# EAGLE design DAQ13 (EAGLE 6.0)
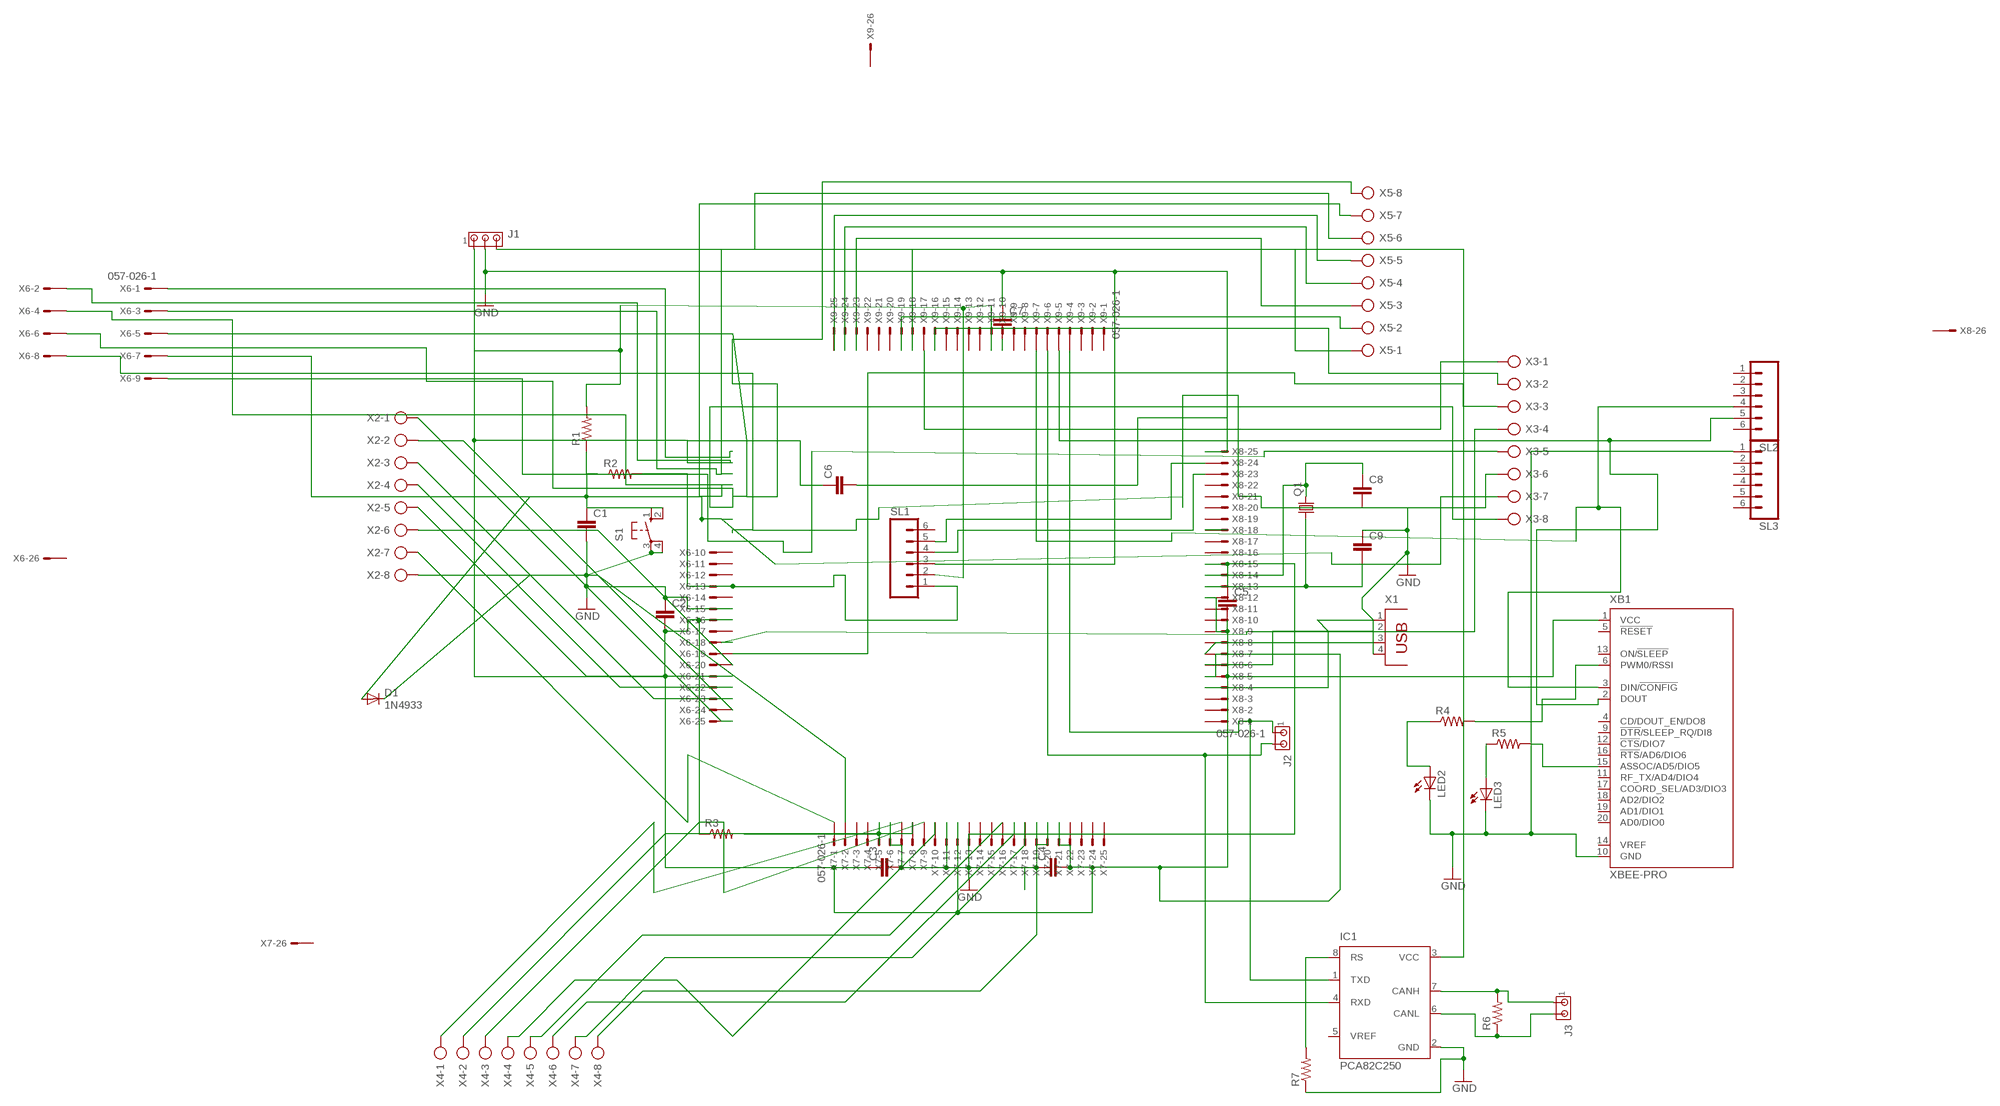
[diagram p0: schematic, sheet 1]

## Parts
C1  C2,5-3  [C2.5-3]
C2  C2.5/2  [C2.5-2]
C3  C2.5/2  [C2.5-2]
C4  C2.5/2  [C2.5-2]
C5  C2.5/2  [C2.5-2]
C6  C2.5/2  [C2.5-2]
C7  C2.5/2  [C2.5-2]
C8  C2,5-3  [C2.5-3]
C9  C2,5-3  [C2.5-3]
D1  1N4933  [DO41-10]
IC1  PCA82C250  [DIL08]
J1  MTA03-156  [1X3MTA]
J2  MTA02-156  [1X2MTA]
J3  MTA02-156  [1X2MTA]
LED2  LED3MM  [LED3MM]
LED3  LED3MM  [LED3MM]
Q1  CRYSTALHC18U-V  [HC18U-V]
R1  R-US_0204/7  [0204/7]
R2  R-US_0204/7  [0204/7]
R3  R-US_0204/7  [0204/7]
R4  R-US_0204/7  [0204/7]
R5  R-US_0204/7  [0204/7]
R6  R-US_0204/7  [0204/7]
R7  R-US_0204/7  [0204/7]
S1  10-XX  [B3F-10XX]
SL1  MA06  [06PA]
SL2  MA06  [06PA]
SL3  MA06  [06PA]
X1  PN87520  [PN87520]
X2  AK300/8  [AK300/8]
X3  AK300/8  [AK300/8]
X4  AK300/8  [AK300/8]
X5  AK300/8  [AK300/8]
X6  057-026-1  [057-026-1]
X7  057-026-1  [057-026-1]
X8  057-026-1  [057-026-1]
X9  057-026-1  [057-026-1]
XB1  XBEE-PRO  [XBEE-PRO]

## Nets
GND: C1.2 C2.1 C3.2 C4.1 C5.1 C6.2 C7.1 C8.2 C9.1 D1.C IC1.2(GND) J1.2 LED2.K(C) LED3.K(C) R7.1 S1.3(P) S1.4(P1) SL1.3 SL3.1 X1.4 X6.15 X7.6 X7.11 X7.20 X8.15 X8.25 XB1.10(GND)
N$1: R2.2 SL1.1 X6.13
N$2: C1.1 D1.A R1.1 R2.1 S1.1(S) S1.2(S1)
N$3: C2.2 C3.1 C4.2 C5.2 C6.1 J1.1 R1.2 R3.1 SL1.2 X6.2 X6.16 X7.12 X7.21 X8.5 X8.12 X9.11 XB1.1(VCC)
N$4: C7.2 X9.10
N$5: R4.2 XB1.6(PWM0/RSSI)
N$6: SL1.4 X8.23
N$7: SL1.5 X8.24
N$8: C8.1 Q1.2 X8.14
N$9: C9.2 Q1.1 X8.13
N$10: R5.2 XB1.15(ASSOC/AD5/DIO5)
N$11: LED3.A R5.1
N$12: LED2.A R4.1
N$13: X4.7 X7.18
N$14: X4.5 X7.16
N$15: X1.1 X8.4
N$16: X1.2 X8.6
N$17: X1.3 X8.7
N$18: X4.6 X7.17
N$19: X2.1 X6.25
N$20: X2.2 X6.24
N$21: X2.3 X6.23
N$22: X2.4 X6.22
N$23: X2.5 X6.21
N$24: X2.6 X6.20
N$25: X2.7 X7.1
N$26: X2.8 X7.2
N$27: X4.1 X7.7
N$28: X4.2 X7.8
N$29: X4.3 X7.9
N$30: X4.4 X7.10
N$31: X4.8 X7.19
N$32: X3.8 X6.6
N$33: X3.7 X6.7
N$34: X5.7 X6.4
N$35: X3.5 X6.9
N$36: X3.4 X6.18
N$37: X3.3 X6.19
N$38: X3.2 X9.16
N$39: X3.1 X9.17
N$40: X5.1 X9.18
N$41: X5.2 X9.19
N$42: X5.3 X9.23
N$43: X5.4 X9.24
N$44: X5.5 X9.25
N$45: X3.6 X6.8
N$46: X5.8 X6.5
N$47: IC1.7(CANH) J3.1 R6.2
N$48: IC1.8(RS) R7.2
N$49: X8.18
N$50: IC1.1(TXD) J2.1 X9.4
N$51: IC1.6(CANL) J3.2 R6.1
N$53: IC1.4(RXD) J2.2 X9.6
N$54: IC1.3(VCC) J1.3
N$56: SL2.5 X9.5 XB1.2(DOUT)
N$57: SL2.4 X9.7 XB1.3(DIN/!CONFIG)
N$58: X6.1
N$59: X5.6 X6.3
N$92: R3.2 X7.5
Unconnected: IC1.5(VREF) SL1.6 SL2.1 SL2.2 SL2.3 SL2.6 SL3.2 SL3.3 SL3.4 SL3.5 SL3.6 X6.10 X6.11 X6.12 X6.14 X6.17 X6.26 X7.3 X7.4 X7.13 X7.14 X7.15 X7.22 X7.23 X7.24 X7.25 X7.26 X8.1 X8.2 X8.3 X8.8 X8.9 X8.10 X8.11 X8.16 X8.17 X8.19 X8.20 X8.21 X8.22 X8.26 X9.1 X9.2 X9.3 X9.8 X9.9 X9.12 X9.13 X9.14 X9.15 X9.20 X9.21 X9.22 X9.26 XB1.4(CD/DOUT_EN/DO8) XB1.5(!RESET) XB1.9(!DTR!/SLEEP_RQ/DI8) XB1.11(RF_TX/AD4/DIO4) XB1.12(!CTS!/DIO7) XB1.13(ON/!SLEEP) XB1.14(VREF) XB1.16(!RTS!/AD6/DIO6) XB1.17(COORD_SEL/AD3/DIO3) XB1.18(AD2/DIO2) XB1.19(AD1/DIO1) XB1.20(AD0/DIO0)

## Library data of the parts
C1-C9 = capacitor-wima:C: CAPACITOR naming: grid - package width
D1 = diode:1N4933: DIODE fast recovery rectifier, 1A
IC1 = micro-philips:PCA82C250: CAN CONTROLLER INTERFACE; OC_FARNELL: 3692358; OC_NEWARK: unknown
J1 = con-amp:MTA03-156: AMP connector
J2 J3 = con-amp:MTA02-156: AMP connector
LED2 LED3 = led:LED: LED OSRAM: - CHIPLED LG R971, LG N971, LY N971, LG Q971, LY Q971, LO R971, LY R971 LH N974, LH R974 LS Q976, LO Q976, LY Q976 LO Q996 - Hyper CHIPLED LW Q18S LB Q993, LB Q99A, LB R99A - SideLED LS A670, LO A670, LY A670, LG A670, LP A670 LB A673, LV A673, LT A673, LW A673 LH A674 LY A675 LS A676, LA A676, LO A676, LY A676, LW A676 LS A679, LY A679, LG A679 - Hyper Micro SIDELED® LS Y876, LA Y876, LO Y876, LY Y876 LT Y87S - SmartLED LW L88C, LW L88S LB L89C, LB L89S, LG L890 LS L89K, LO L89K, LY L89K LS L896, LA L896, LO L896, LY L896 - TOPLED LS T670, LO T670, LY T670, LG T670, LP T670 LSG T670, LSP T670, LSY T670, LOP T670, LYG T670 LG T671, LOG T671, LSG T671 LB T673, LV T673, LT T673, LW T673 LH T674 LS T676, LA T676, LO T676, LY T676, LB T676, LH T676, LSB T676, LW T676 LB T67C, LV T67C, LT T67C, LS T67K, LO T67K, LY T67K, LW E67C LS E67B, LA E67B, LO E67B, LY E67B, LB E67C, LV E67C, LT E67C LW T67C LS T679, LY T679, LG T679 LS T770, LO T770, LY T770, LG T770, LP T770 LB T773, LV T773, LT T773, LW T773 LH T774 LS E675, LA E675, LY E675, LS T675 LS T776, LA T776, LO T776, LY T776, LB T776 LHGB T686 LT T68C, LB T68C - Hyper Mini TOPLED® LB M676 - Mini TOPLED Santana® LG M470 LS M47K, LO M47K, LY M47K Source: http://www.osram.convergy.de LUXEON: - LUMILED® LXK2-PW12-R00, LXK2-PW12-S00, LXK2-PW14-U00, LXK2-PW14-V00 LXK2-PM12-R00, LXK2-PM12-S00, LXK2-PM14-U00 LXK2-PE12-Q00, LXK2-PE12-R00, LXK2-PE12-S00, LXK2-PE14-T00, LXK2-PE14-U00 LXK2-PB12-K00, LXK2-PB12-L00, LXK2-PB12-M00, LXK2-PB14-N00, LXK2-PB14-P00, LXK2-PB14-Q00 LXK2-PR12-L00, LXK2-PR12-M00, LXK2-PR14-Q00, LXK2-PR14-R00 LXK2-PD12-Q00, LXK2-PD12-R00, LXK2-PD12-S00 LXK2-PH12-R00, LXK2-PH12-S00 LXK2-PL12-P00, LXK2-PL12-Q00, LXK2-PL12-R00 Source: www.luxeon.com KINGBRIGHT: KA-3528ASYC Source: www.kingbright.com
Q1 = crystal:CRYSTAL: CRYSTAL; OC_FARNELL: unknown; OC_NEWARK: unknown
R1-R7 = rcl:R-US_: RESISTOR, American symbol
S1 = switch-omron:10-XX: OMRON SWITCH; MPN: B3F-1000; OC_FARNELL: 176432; OC_NEWARK: 36M3542
SL1-SL3 = con-amp-quick:MA06: AMP QUICK CONNECTOR; OC_FARNELL: unknown; OC_NEWARK: unknown
X1 = con-berg:PN87520: BERG USB connector; OC_FARNELL: unknown; OC_NEWARK: unknown
X2-X5 = con-ptr500:AK300/8: CONNECTOR; OC_FARNELL: unknown; OC_NEWARK: unknown
X6-X9 = con-panduit:057-026-: CONNECTOR 20-pin series 057 contact pc board low profile headers; OC_FARNELL: unknown; OC_NEWARK: unknown
XB1 = maxstream:XBEE: XBee (TM) /XBee-PRO(TM) OEM RF Modules Source: MaxStream, Inc. xbee_productmanual.pdf; MPN: XBP24-AWI-001; OC_FARNELL: 1337916; OC_NEWARK: 42M2667

## Board
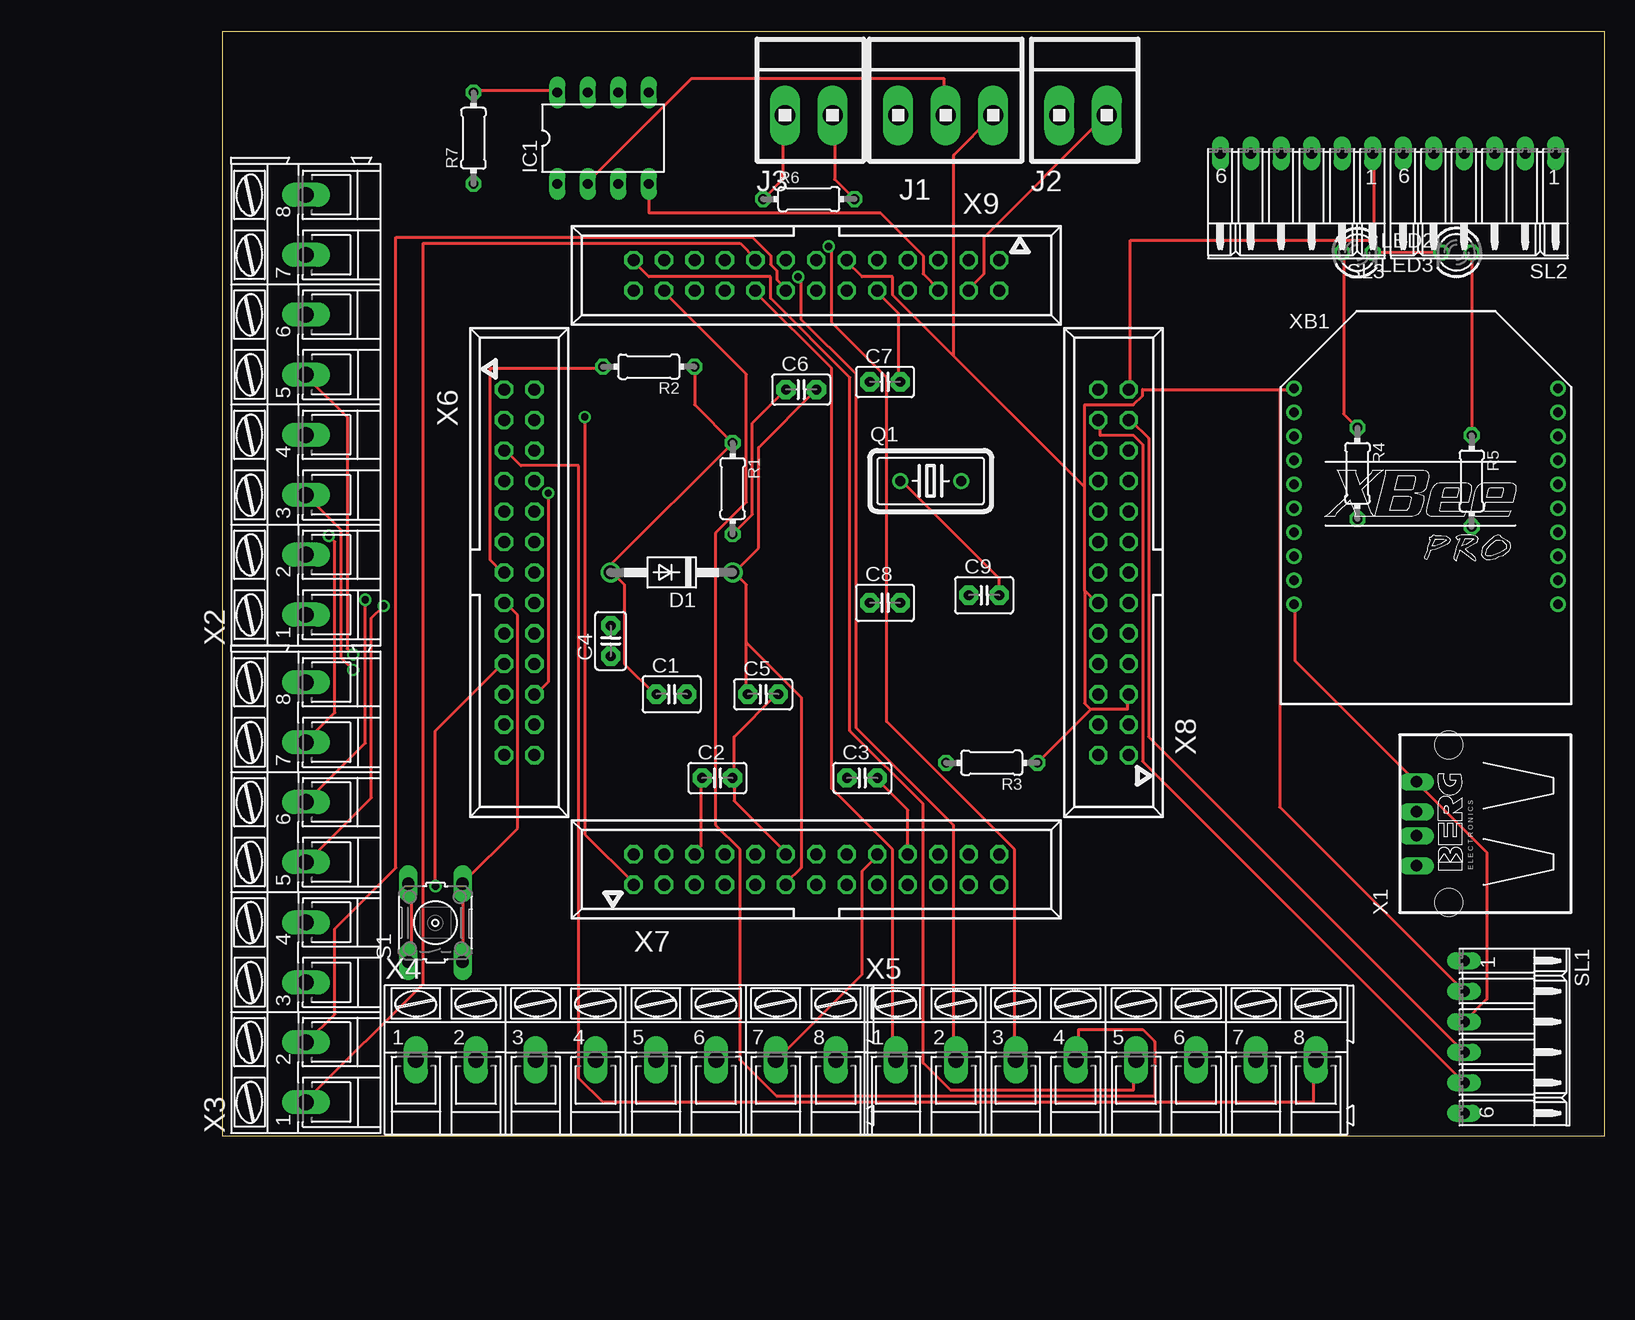
[diagram p1: board, top side]
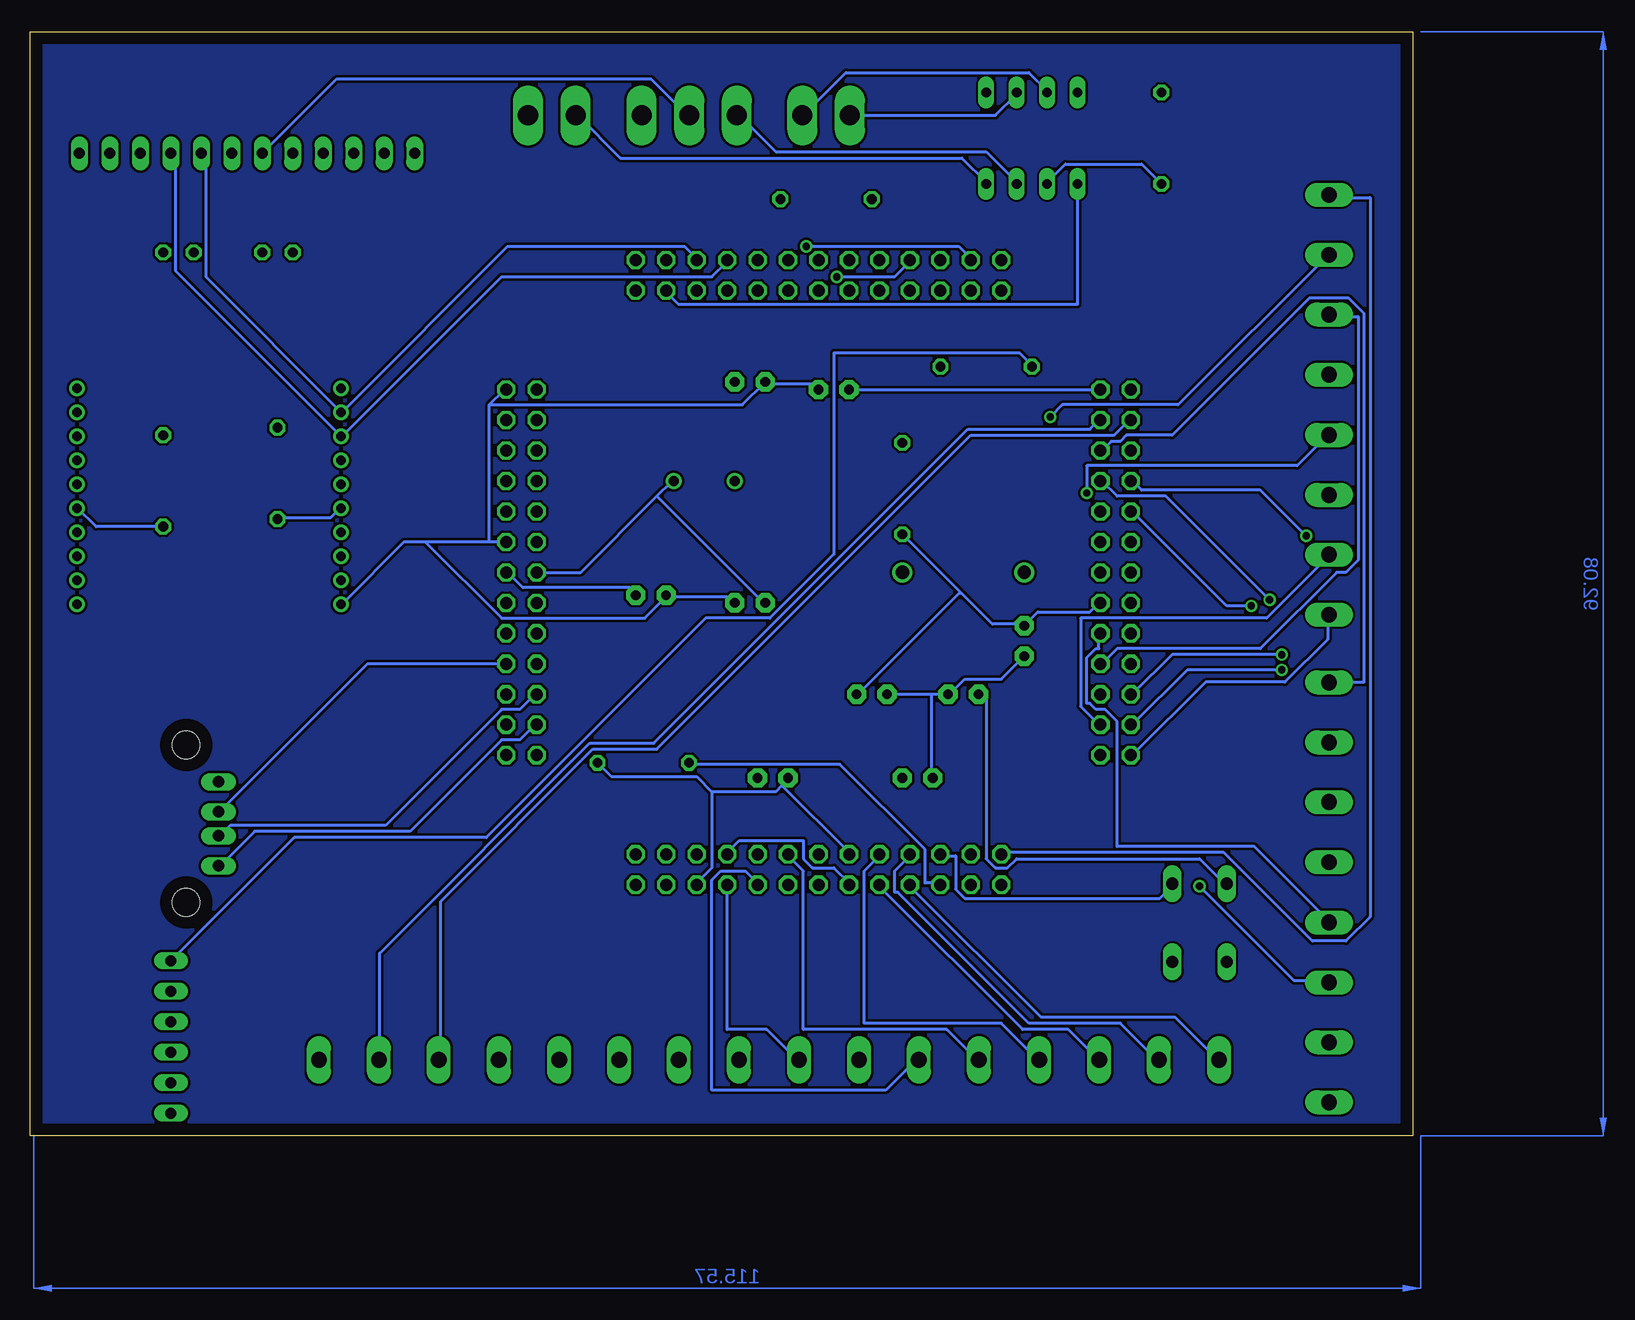
[diagram p2: board, bottom side, seen from below]

Size 115.24 x 92.06 mm. Coordinates in mm from the lower left corner, seen from the top.
Outline: 0,0 115.24,0 115.24,92.06 0,92.06 0,0
Copper layers (1*16): Top 0.035mm / dielectric 1.5mm / Bottom 0.035mm
Design rules: minimum track width 10mil, minimum drill 24mil, track to track 8mil, track to pad 8mil, pad to pad 8mil, via to via 8mil, smd to smd 8mil, copper to edge 40mil, drill to drill 8mil, minimum pad ring 10mil, minimum via ring 8mil, stop-mask expansion 4mil, vias tented up to drill 0mil, thermal gap 10mil

### Footprints (pad centres in the part's own frame; a part is rotated, then mirrored left to right if it is on the bottom)
C2.5-3 = drill 0.813 pad 1.6 octagon: 1 -1.27,0; 2 1.27,0
C2.5-2 = drill 0.813 pad 1.6 octagon: 1 -1.27,0; 2 1.27,0
DO41-10 = drill 1.118: A 5.08,0; C -5.08,0
DIL08 = drill 0.813 long: 1 -3.81,-3.81; 2 -1.27,-3.81; 3 1.27,-3.81; 4 3.81,-3.81; 5 3.81,3.81; 6 1.27,3.81; 7 -1.27,3.81; 8 -3.81,3.81
1X3MTA = drill 1.676 long: 1 3.937,0; 2 -0.025,0; 3 -3.988,0
1X2MTA = drill 1.676 long: 1 1.981,0; 2 -1.981,0
LED3MM = drill 0.813 octagon: A -1.27,0; K 1.27,0
HC18U-V = drill 0.813: 1 -2.54,0; 2 2.54,0
0204/7 = drill 0.813 octagon: 1 -3.81,0; 2 3.81,0
B3F-10XX = drill 1.016 long: 1 -3.251,2.261; 2 3.251,2.261; 3 -3.251,-2.261; 4 3.251,-2.261
06PA = drill 0.914 long: 1 -6.35,0; 2 -3.81,0; 3 -1.27,0; 4 1.27,0; 5 3.81,0; 6 6.35,0
PN87520 = drill 0.95 long: 1 -3.5,2.71; 2 -1,2.71; 3 1,2.71; 4 3.5,2.71 | hole 2.3: -6.57,0; 6.57,0
AK300/8 = drill 1.321 long: 1 -17.501,0; 2 -12.497,0; 3 -7.518,0; 4 -2.515,0; 5 2.515,0; 6 7.518,0; 7 12.497,0; 8 17.501,0
057-026-1 = drill 1 octagon: 1 -15.24,-1.27; 2 -15.24,1.27; 3 -12.7,-1.27; 4 -12.7,1.27; 5 -10.16,-1.27; 6 -10.16,1.27; 7 -7.62,-1.27; 8 -7.62,1.27; 9 -5.08,-1.27; 10 -5.08,1.27; 11 -2.54,-1.27; 12 -2.54,1.27; 13 0,-1.27; 14 0,1.27; 15 2.54,-1.27; 16 2.54,1.27; 17 5.08,-1.27; 18 5.08,1.27; 19 7.62,-1.27; 20 7.62,1.27; 21 10.16,-1.27; 22 10.16,1.27; 23 12.7,-1.27; 24 12.7,1.27; 25 15.24,-1.27; 26 15.24,1.27
XBEE-PRO = drill 0.8 pad 1.27: 1 -11,9; 2 -11,7; 3 -11,5; 4 -11,3; 5 -11,1; 6 -11,-1; 7 -11,-3; 8 -11,-5; 9 -11,-7; 10 -11,-9; 11 11,-9; 12 11,-7; 13 11,-5; 14 11,-3; 15 11,-1; 16 11,1; 17 11,3; 18 11,5; 19 11,7; 20 11,9

### Placement (x,y rotation side)
C1  37.46,36.83 0 top
C2  41.27,29.84 0 top
C3  53.34,29.84 0 top
C4  32.38,41.28 90 top
C5  45.09,36.83 0 top
C6  48.26,62.23 0 top
C7  55.25,62.87 0 top
C8  55.25,44.45 0 top
C9  63.5,45.09 0 top
D1  37.46,46.99 180 top
IC1  31.75,83.19 0 top
J1  60.33,85.09 0 top
J2  71.75,85.09 0 top
J3  48.9,85.09 0 top
LED2  94.61,73.66 0 top
LED3  102.87,73.66 180 top
Q1  59.05,54.61 0 top
R1  42.55,53.98 270 top
R2  35.56,64.14 180 top
R3  64.13,31.11 180 top
R4  94.61,55.25 270 top
R5  104.14,54.61 270 top
R6  48.9,78.11 0 top
R7  20.95,83.19 90 top
S1  17.78,17.78 90 top
SL1  103.5,8.26 270 top
SL2  104.77,81.92 180 top
SL3  89.53,81.92 180 top
X1  102.23,26.04 90 top
X2  6.98,60.96 90 top
X3  6.98,20.32 90 top
X4  33.66,6.35 0 top
X5  73.66,6.35 0 top
X6  24.77,46.99 270 top
X7  49.53,22.22 0 top
X8  74.29,46.99 90 top
X9  49.53,71.75 180 top
XB1  100.33,53.34 0 top

### Tracks (layer width: path | path; a pad name or v marks a point on that pad's centre or on a via)
GN
  pour Bottom: -0.64,0 114.93,0 114.93,92.08 -0.64,92.08
GND
  Top 0.254: LED3.K 96.01,73.66 | 96.01,73.66 96.01,74.68 | 96.01,74.68 96.01,81.79 SL3.1 | 96.01,73.66 LED2.K | IC1.2 30.48,79.5 39.12,88.14 60.2,88.14 60.2,85.09 J1.2 | X6.15 23.62,44.45 24.64,43.43 24.64,25.65 20.07,21.08 S1.4 20.07,20.83 20.07,14.73 S1.3 | X7.20 57.15,27.18 54.61,29.72 C3.2 | X7.6 39.37,23.62 39.88,24.13 39.88,29.72 C2.1 | 42.67,46.99 43.69,45.97 43.69,41.15 | 43.69,41.15 43.69,36.83 C5.1 | C6.2 44.7,57.4 44.7,49.02 42.67,46.99 | 42.67,46.99 D1.C | 43.69,41.15 48.26,36.58 48.26,22.35 46.99,21.08 X7.11 | SL1.3 105.41,11.43 105.41,23.62 99.57,29.46 X1.4 99.31,29.72 89.41,39.62 89.41,44.2 XB1.10 89.41,44.45 | 96.01,74.68 75.69,74.68 75.69,62.23 X8.25
  Bottom 0.254: R7.1 22.61,81.03 28.96,81.03 30.48,79.5 IC1.2 | SL3.1 89.66,88.14 63.5,88.14 60.45,85.09 J1.2 | X7.11 46.99,21.08 48.26,22.35 50.04,22.35 50.8,23.11 50.8,24.64 56.13,24.64 57.15,23.62 X7.20 | C6.2 50.04,62.74 53.85,62.74 C7.1 55.88,60.96 76.96,60.96 | C5.1 40.13,36.83 | 40.13,36.83 C1.2 38.61,36.83 37.34,38.1 34.29,38.1 C4.1 | 40.13,36.83 40.13,29.97 C2.1 | S1.4 20.07,20.83 21.08,19.81 37.34,19.81 38.1,20.57 38.1,23.37 39.37,23.37 X7.6 | 62.23,44.96 57.15,44.96 56.64,44.45 C8.2 | X8.15 76.96,49.53 | 76.96,49.53 82.3,49.53 | 82.3,49.53 84.07,49.53 89.15,44.45 XB1.10 | 76.96,60.96 75.69,62.23 X8.25 | 76.96,49.53 76.96,60.96 | 62.23,44.96 64.01,43.18 75.95,43.18 82.3,49.53 | 62.23,44.96 C9.1
N$1
  Top 0.254: R2.2 31.75,64.01 22.35,64.01 22.35,48.01 23.37,46.99 X6.13
  Bottom 0.254: SL1.1 93.22,24.89 77.22,24.89 58.93,43.18 53.59,43.18 48.26,48.51 48.26,65.28 32.77,65.28 31.75,64.26 R2.2
N$2
  Top 0.254: R2.1 39.37,60.96 R1.1 32.51,47.75 32.51,46.99 | S1.1 15.75,14.73 15.75,20.83 S1.2 | 32.51,46.99 33.53,45.97 33.53,39.37 36.07,36.83 C1.1 | 32.51,46.99 D1.A
  Bottom 0.254: C1.1 35.56,36.83 35.56,23.11 34.8,22.35 33.78,22.35 33.02,23.11 17.78,23.11 15.75,21.08 S1.2
N$3
  Top 0.254: X7.12 46.99,23.62 42.67,27.94 42.67,29.72 C2.2 42.67,29.97 42.67,33.27 46.23,36.83 C5.2 | C6.1 44.2,59.44 44.2,51.82 R1.2 | 72.39,35.56 R3.1 | 72.39,35.56 75.44,35.56 75.44,36.83 X8.5 | 88.14,62.23 76.71,62.23 76.71,61.72 75.95,60.96 71.88,60.96 71.88,54.1 | 88.14,62.23 89.15,62.23 XB1.1 | 71.88,45.47 71.88,54.1 | 71.88,45.47 72.9,44.45 X8.12 | SL1.2 88.14,27.43 88.14,62.23 | 71.88,54.1 60.96,65.02 | 60.96,65.02 55.88,70.1 55.88,71.63 53.34,71.63 52.07,72.9 X9.11 | J1.1 60.96,81.79 60.96,65.02 | 72.39,35.56 71.88,36.07 71.88,45.47
  Bottom 0.254: 58.42,28.7 58.42,22.35 59.69,21.08 X7.21 | 58.42,28.7 53.09,28.7 52.58,29.21 | 52.58,29.21 52.07,29.72 C3.1 | 52.58,29.21 46.99,23.62 X7.12 | C6.1 X6.2 | 37.59,45.21 35.05,42.67 32.51,42.67 C4.2 31.24,43.69 26.92,43.69 26.16,44.45 X6.16 | 37.59,45.21 R1.2 | 37.59,45.21 37.85,45.21 46.23,36.83 C5.2 | 58.42,28.7 59.69,29.97 66.8,29.97 R3.1
N$4
  Top 0.254: X9.10 54.61,70.36 56.39,68.58 56.39,62.99 C7.2
N$5
  Bottom 0.254: XB1.6 89.41,52.32 90.17,51.56 94.49,51.56 R4.2
N$6
  Top 0.254: SL1.4 77.22,33.27 77.22,58.17 75.69,59.69 X8.23
N$7
  Top 0.254: SL1.5 76.71,31.24 76.71,57.66 75.95,58.42 73.15,58.42 73.15,59.69 X8.24
N$8
  Bottom 0.254: 62.99,53.34 69.34,46.99 X8.14 | 62.99,53.34 61.72,54.61 Q1.2 | 62.99,53.34 54.1,44.45 C8.1
N$9
  Top 0.254: C9.2 64.77,46.48 56.64,54.61 Q1.1
  Bottom 0.254: X8.13 75.44,46.99 74.17,45.72 65.28,45.72 64.77,45.21 C9.2
N$10
  Bottom 0.254: R5.2 109.73,50.8 111.25,52.32 XB1.15
N$11
  Top 0.254: LED3.A R5.1
N$12
  Top 0.254: R4.1 93.47,60.2 93.47,73.66 LED2.A
N$13
  Top 0.254: X7.18 54.61,23.37 53.34,22.1 53.34,13.46 46.23,6.35 X4.7
N$14
  Bottom 0.254: X7.16 52.07,23.37 50.8,22.1 50.8,8.89 38.86,8.89 36.32,6.35 X4.5
N$15
  Bottom 0.254: X1.1 99.31,22.61 96.52,25.4 83.57,25.4 75.95,33.02 74.42,33.02 73.15,34.29 X8.4
N$16
  Bottom 0.254: X1.2 99.31,25.15 98.55,25.91 85.6,25.91 75.95,35.56 74.42,35.56 73.15,36.83 X8.6
N$17
  Bottom 0.254: X8.7 87.12,39.37 99.31,27.18 X1.3
N$18
  Bottom 0.254: X7.17 54.61,21.08 55.63,22.1 57.66,22.1 58.42,21.34 58.42,3.81 43.94,3.81 41.4,6.35 X4.6
N$19
  Bottom 0.254: X6.25 23.37,31.75 17.27,37.85 10.67,37.85 7.11,41.4 7.11,43.43 X2.1
N$20
  Bottom 0.254: X6.24 26.16,34.29 27.69,35.81 27.69,43.18 12.19,43.18 7.11,48.26 X2.2
N$21  (via drill 0.61)
  Top 0.254: v10.92,38.86 9.91,39.88 9.91,50.55 7.11,53.34 X2.3
  Bottom 0.254: v10.92,38.86 18.8,38.86 23.37,34.29 X6.23
N$22  (via drill 0.61)
  Top 0.254: v27.18,53.59 27.18,37.85 26.16,36.83 X6.22
  Bottom 0.254: v27.18,53.59 27.18,55.88 9.65,55.88 7.11,58.42 X2.4
N$23  (via drill 0.61)
  Top 0.254: v10.92,40.13 10.41,40.64 10.41,59.94 7.11,63.25 X2.5
  Bottom 0.254: v10.92,40.13 20.07,40.13 23.37,36.83 X6.21
N$24
  Bottom 0.254: X6.20 25.91,39.37 24.64,40.64 12.7,40.64 6.35,46.99 5.59,46.99 4.57,48.01 4.57,68.33 6.86,68.33 X2.6
N$25  (via drill 0.61)
  Top 0.254: v30.23,59.94 30.23,25.15 34.29,21.08 X7.1
  Bottom 0.254: v30.23,59.94 29.21,60.96 19.56,60.96 7.11,73.41 X2.7
N$26
  Bottom 0.254: X7.2 34.29,23.62 15.75,23.62 8.38,16.26 5.59,16.26 3.56,18.29 3.56,78.23 6.86,78.23 X2.8
N$27
  Bottom 0.254: X7.7 41.91,20.83 30.99,9.91 19.81,9.91 16.26,6.35 X4.1
N$28
  Bottom 0.254: X7.8 41.91,23.37 43.18,22.1 43.18,20.32 42.93,20.32 32,9.4 24.38,9.4 21.34,6.35 X4.2
N$29
  Bottom 0.254: X7.9 44.45,20.83 32.51,8.89 28.7,8.89 26.16,6.35 X4.3
N$30
  Bottom 0.254: X7.10 44.45,23.37 45.72,22.1 45.72,9.4 34.29,9.4 31.24,6.35 X4.4
N$31
  Bottom 0.254: X7.19 57.15,8.89 53.85,8.89 51.31,6.35 X4.8
N$32
  Bottom 0.254: X6.6 25.91,57.15 25.15,57.91 24.38,57.91 23.88,58.42 20.07,58.42 8.64,69.85 5.33,69.85 4.06,68.58 4.06,37.85 6.86,37.85 X3.8
N$33  (via drill 0.61)
  Top 0.254: v8.89,50.04 9.4,49.53 9.4,35.31 7.11,33.02 X3.7
  Bottom 0.254: v8.89,50.04 12.7,53.85 22.61,53.85 23.37,54.61 X6.7
N$34
  Bottom 0.254: X6.4 26.16,59.69 26.92,58.93 37.08,58.93 63.25,32.77 68.58,32.77 86.11,15.24 86.11,6.35 X5.7
N$35  (via drill 0.61)
  Top 0.254: v13.46,44.2 12.45,43.18 12.45,28.19 7.11,22.86 X3.5
  Bottom 0.254: v13.46,44.2 15.49,44.2 23.37,52.07 X6.9
N$36
  Bottom 0.254: X6.18 26.16,41.91 26.16,40.64 26.42,40.64 27.18,39.88 27.18,36.07 26.92,36.07 26.42,35.56 25.65,35.56 24.64,34.54 24.64,24.13 13.21,24.13 7.11,18.03 X3.4
N$37  (via drill 0.61)
  Top 0.254: v17.78,20.83 17.78,33.78 23.37,39.37 X6.19
  Bottom 0.254: v17.78,20.83 9.91,12.95 7.11,12.95 X3.3
N$38
  Top 0.254: X9.16 46.99,70.61 46.23,71.37 46.23,72.14 45.72,72.64 45.72,73.41 44.2,74.93 14.48,74.93 14.48,22.35 9.4,17.27 9.4,10.16 7.11,7.87 X3.2
N$39
  Top 0.254: X9.17 44.45,73.15 43.18,74.42 16.76,74.42 16.76,12.7 7.11,3.05 X3.1
N$40
  Top 0.254: X9.18 44.45,70.36 50.8,64.01 50.8,28.96 55.88,23.88 55.88,6.6 56.13,6.35 X5.1
N$41  (via drill 0.61)
  Top 0.254: v48.01,71.63 48.26,71.37 48.26,68.07 52.83,63.5 52.83,34.04 60.96,25.91 60.96,6.35 X5.2
  Bottom 0.254: v48.01,71.63 43.18,71.63 41.91,72.9 X9.19
N$42  (via drill 0.61)
  Top 0.254: v50.55,74.17 50.8,73.91 50.8,67.82 55.37,63.25 55.37,34.54 66.04,23.88 66.04,6.35 X5.3
  Bottom 0.254: v50.55,74.17 37.85,74.17 36.83,73.15 X9.23
N$43
  Top 0.254: X9.24 36.83,70.36 43.69,63.5 43.69,52.83 41.15,50.29 41.15,25.91 43.18,23.88 43.18,6.35 46.23,3.3 77.72,3.3 77.72,7.87 76.71,8.89 71.37,8.89 71.37,6.35 X5.4
N$44
  Top 0.254: X9.25 34.29,72.9 35.56,71.63 45.72,71.63 45.72,69.85 52.32,63.25 52.32,33.78 58.42,27.69 58.42,6.1 60.71,3.81 75.95,3.81 75.95,6.35 X5.5
N$45  (via drill 0.61)
  Top 0.254: v11.94,44.7 11.94,32.77 7.11,27.94 X3.6
  Bottom 0.254: v11.94,44.7 20.57,53.34 24.64,53.34 25.91,54.61 X6.8
N$46
  Top 0.254: X6.5 23.62,57.15 24.89,55.88 29.72,55.88 29.72,4.83 31.75,2.79 90.93,2.79 90.93,6.35 X5.8
N$47
  Top 0.254: R6.2 51.05,79.76 51.05,85.09 J3.1
  Bottom 0.254: IC1.7 30.48,87.12 32,88.65 47.24,88.65 50.8,85.09 J3.1
N$48
  Top 0.254: R7.2 21.08,87.12 27.94,87.12 IC1.8
N$50
  Top 0.254: J2.1 73.66,85.09 63.5,74.93 63.5,71.88 62.23,70.61 X9.4
  Bottom 0.254: IC1.1 27.94,69.34 61.21,69.34 62.23,70.36 X9.4
N$51
  Top 0.254: R6.1 46.74,79.76 46.74,85.09 J3.2
  Bottom 0.254: J3.2 34.8,85.09 33.02,86.87 IC1.6
N$53
  Top 0.254: IC1.4 35.56,76.96 54.86,76.96 58.42,73.41 58.42,71.88 59.69,70.61 X9.6
  Bottom 0.254: IC1.4 35.56,79.5 37.59,81.53 66.04,81.53 69.6,85.09 J2.2
N$54
  Bottom 0.254: IC1.3 33.02,79.5 35.56,82.04 53.09,82.04 56.13,85.09 J1.3
N$56
  Bottom 0.254: SL2.5 100.84,81.79 100.58,81.79 100.58,71.63 89.41,60.45 XB1.2 89.15,60.45 75.44,74.17 60.71,74.17 59.69,73.15 X9.5
N$57
  Bottom 0.254: SL2.4 103.38,81.79 103.12,81.79 103.12,72.14 89.41,58.42 XB1.3 89.15,58.42 75.95,71.63 58.42,71.63 57.15,72.9 X9.7
N$59
  Bottom 0.254: X6.3 23.62,59.69 24.89,58.42 36.83,58.42 62.99,32.26 68.33,32.26 81.03,19.56 81.03,6.35 X5.6
N$92
  Bottom 0.254: R3.2 60.2,30.99 47.75,30.99 40.64,23.88 40.64,21.08 39.37,21.08 X7.5
(copper drawn outside any net)
  shapes: Bottom area x2